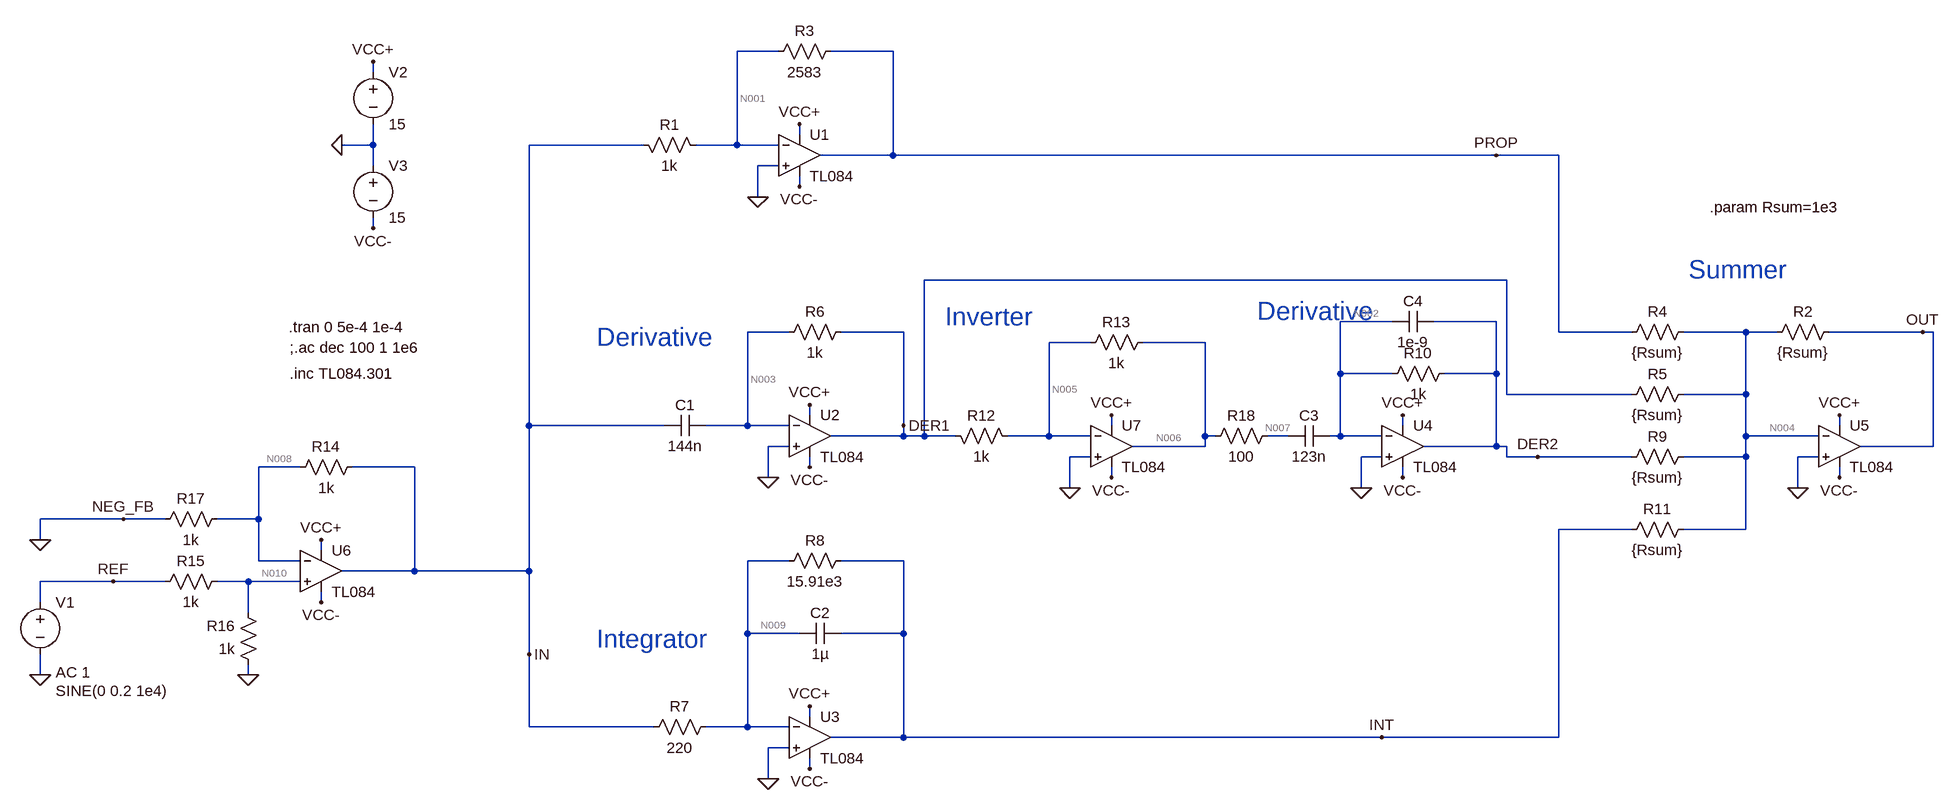
[diagram p0: schematic circuit.asc]
circuit.asc, the LTspice schematic file:
Version 4
SHEET 1 1592 1364
WIRE -208 -64 -272 -64
WIRE -32 -64 -128 -64
WIRE -832 -32 -832 -48
WIRE -176 64 -176 48
WIRE -832 80 -832 48
WIRE -832 80 -880 80
WIRE -416 80 -592 80
WIRE -272 80 -272 -64
WIRE -272 80 -336 80
WIRE -208 80 -272 80
WIRE -32 96 -32 -64
WIRE -32 96 -144 96
WIRE 896 96 -32 96
WIRE 992 96 896 96
WIRE -832 112 -832 80
WIRE -208 112 -240 112
WIRE -176 144 -176 128
WIRE -240 160 -240 112
WIRE -832 208 -832 192
WIRE 912 288 16 288
WIRE 736 352 656 352
WIRE 896 352 800 352
WIRE -192 368 -256 368
WIRE -16 368 -112 368
WIRE 992 368 992 96
WIRE 1104 368 992 368
WIRE 1280 368 1184 368
WIRE 1328 368 1280 368
WIRE 1552 368 1408 368
WIRE 1568 368 1552 368
WIRE 272 384 208 384
WIRE 448 384 352 384
WIRE 656 432 656 352
WIRE 736 432 656 432
WIRE 896 432 896 352
WIRE 896 432 816 432
WIRE 912 464 912 288
WIRE 1104 464 912 464
WIRE 1280 464 1280 368
WIRE 1280 464 1184 464
WIRE -160 496 -160 480
WIRE -592 512 -592 80
WIRE -384 512 -592 512
WIRE -256 512 -256 368
WIRE -256 512 -320 512
WIRE -192 512 -256 512
WIRE -16 512 -16 368
WIRE 304 512 304 496
WIRE 752 512 752 496
WIRE 1424 512 1424 496
WIRE -16 528 -16 512
WIRE -16 528 -128 528
WIRE 16 528 16 288
WIRE 16 528 -16 528
WIRE 64 528 16 528
WIRE 208 528 208 384
WIRE 208 528 144 528
WIRE 272 528 208 528
WIRE 448 528 448 384
WIRE 464 528 448 528
WIRE 576 528 544 528
WIRE 656 528 656 432
WIRE 656 528 640 528
WIRE 720 528 656 528
WIRE 1280 528 1280 464
WIRE 1392 528 1280 528
WIRE -192 544 -224 544
WIRE 448 544 448 528
WIRE 448 544 336 544
WIRE 896 544 896 432
WIRE 896 544 784 544
WIRE 912 544 896 544
WIRE 1568 544 1568 368
WIRE 1568 544 1456 544
WIRE 272 560 240 560
WIRE 720 560 688 560
WIRE 912 560 912 544
WIRE 960 560 912 560
WIRE 1104 560 960 560
WIRE 1280 560 1280 528
WIRE 1280 560 1184 560
WIRE 1392 560 1360 560
WIRE -944 576 -1008 576
WIRE -768 576 -864 576
WIRE -160 576 -160 560
WIRE -224 592 -224 544
WIRE 304 592 304 576
WIRE 752 592 752 576
WIRE 1424 592 1424 576
WIRE 240 608 240 560
WIRE 688 608 688 560
WIRE 1360 608 1360 560
WIRE -1216 656 -1344 656
WIRE -1152 656 -1216 656
WIRE -1008 656 -1008 576
WIRE -1008 656 -1072 656
WIRE 1104 672 992 672
WIRE 1280 672 1280 560
WIRE 1280 672 1184 672
WIRE -1344 688 -1344 656
WIRE -912 704 -912 688
WIRE -1008 720 -1008 656
WIRE -944 720 -1008 720
WIRE -192 720 -256 720
WIRE -16 720 -112 720
WIRE -768 736 -768 576
WIRE -768 736 -880 736
WIRE -592 736 -592 512
WIRE -592 736 -768 736
WIRE -1232 752 -1344 752
WIRE -1152 752 -1232 752
WIRE -1024 752 -1072 752
WIRE -944 752 -1024 752
WIRE -1344 784 -1344 752
WIRE -912 784 -912 768
WIRE -1024 800 -1024 752
WIRE -256 832 -256 720
WIRE -176 832 -256 832
WIRE -16 832 -16 720
WIRE -16 832 -112 832
WIRE -592 864 -592 736
WIRE -1344 896 -1344 864
WIRE -1024 896 -1024 880
WIRE -160 960 -160 944
WIRE -592 976 -592 864
WIRE -400 976 -592 976
WIRE -256 976 -256 832
WIRE -256 976 -320 976
WIRE -192 976 -256 976
WIRE -16 992 -16 832
WIRE -16 992 -128 992
WIRE 720 992 -16 992
WIRE 992 992 992 672
WIRE 992 992 720 992
WIRE -192 1008 -224 1008
WIRE -160 1040 -160 1024
WIRE -224 1056 -224 1008
FLAG -240 160 0
FLAG -880 80 0
FLAG -832 208 VCC-
FLAG -832 -48 VCC+
FLAG -176 48 VCC+
FLAG -176 144 VCC-
FLAG -1344 896 0
FLAG -224 592 0
FLAG -160 480 VCC+
FLAG -160 576 VCC-
FLAG -224 1056 0
FLAG -160 944 VCC+
FLAG -160 1040 VCC-
FLAG 688 608 0
FLAG 752 496 VCC+
FLAG 752 592 VCC-
FLAG 1360 608 0
FLAG 1424 496 VCC+
FLAG 1424 592 VCC-
FLAG 896 96 PROP
FLAG 1552 368 OUT
FLAG -16 512 DER1
FLAG 960 560 DER2
FLAG 720 992 INT
FLAG -592 864 IN
FLAG 240 608 0
FLAG 304 496 VCC+
FLAG 304 592 VCC-
FLAG -912 688 VCC+
FLAG -912 784 VCC-
FLAG -1024 896 0
FLAG -1232 752 REF
FLAG -1216 656 NEG_FB
FLAG -1344 688 0
SYMBOL Opamps\\opamp2 -176 32 R0
SYMATTR InstName U1
SYMATTR Value TL084
SYMBOL res -432 64 M90
WINDOW 0 0 56 VBottom 2
WINDOW 3 32 56 VTop 2
SYMATTR InstName R1
SYMATTR Value 1k
SYMBOL voltage -1344 768 R0
WINDOW 3 24 152 Left 2
WINDOW 123 24 124 Left 2
WINDOW 39 0 0 Left 0
SYMATTR Value SINE(0 0.2 1e4)
SYMATTR Value2 AC 1
SYMATTR InstName V1
SYMBOL voltage -832 -48 R0
WINDOW 123 0 0 Left 0
WINDOW 39 0 0 Left 0
SYMATTR InstName V2
SYMATTR Value 15
SYMBOL voltage -832 96 R0
WINDOW 123 0 0 Left 0
WINDOW 39 0 0 Left 0
SYMATTR InstName V3
SYMATTR Value 15
SYMBOL res -112 -80 R90
WINDOW 0 0 56 VBottom 2
WINDOW 3 32 56 VTop 2
SYMATTR InstName R3
SYMATTR Value 2583
SYMBOL Opamps\\opamp2 -160 464 R0
SYMATTR InstName U2
SYMATTR Value TL084
SYMBOL res -96 352 R90
WINDOW 0 0 56 VBottom 2
WINDOW 3 32 56 VTop 2
SYMATTR InstName R6
SYMATTR Value 1k
SYMBOL cap -320 496 R90
WINDOW 0 0 32 VBottom 2
WINDOW 3 32 32 VTop 2
SYMATTR InstName C1
SYMATTR Value 144n
SYMBOL Opamps\\opamp2 -160 928 R0
SYMATTR InstName U3
SYMATTR Value TL084
SYMBOL res -304 960 R90
WINDOW 0 0 56 VBottom 2
WINDOW 3 32 56 VTop 2
SYMATTR InstName R7
SYMATTR Value 220
SYMBOL cap -112 816 R90
WINDOW 0 0 32 VBottom 2
WINDOW 3 32 32 VTop 2
SYMATTR InstName C2
SYMATTR Value 1µ
SYMBOL res -96 704 R90
WINDOW 0 0 56 VBottom 2
WINDOW 3 32 56 VTop 2
SYMATTR InstName R8
SYMATTR Value 15.91e3
SYMBOL Opamps\\opamp2 752 480 R0
SYMATTR InstName U4
SYMATTR Value TL084
SYMBOL res 832 416 R90
WINDOW 0 0 56 VBottom 2
WINDOW 3 32 56 VTop 2
SYMATTR InstName R10
SYMATTR Value 1k
SYMBOL cap 640 512 R90
WINDOW 0 0 32 VBottom 2
WINDOW 3 32 32 VTop 2
SYMATTR InstName C3
SYMATTR Value 123n
SYMBOL Opamps\\opamp2 1424 480 R0
SYMATTR InstName U5
SYMATTR Value TL084
SYMBOL res 1424 352 R90
WINDOW 0 0 56 VBottom 2
WINDOW 3 32 56 VTop 2
SYMATTR InstName R2
SYMATTR Value {Rsum}
SYMBOL res 1200 352 R90
WINDOW 0 0 56 VBottom 2
WINDOW 3 32 56 VTop 2
SYMATTR InstName R4
SYMATTR Value {Rsum}
SYMBOL res 1200 448 R90
WINDOW 0 0 56 VBottom 2
WINDOW 3 32 56 VTop 2
SYMATTR InstName R5
SYMATTR Value {Rsum}
SYMBOL res 1200 544 R90
WINDOW 0 0 56 VBottom 2
WINDOW 3 32 56 VTop 2
SYMATTR InstName R9
SYMATTR Value {Rsum}
SYMBOL res 1200 656 R90
WINDOW 0 0 56 VBottom 2
WINDOW 3 32 56 VTop 2
SYMATTR InstName R11
SYMATTR Value {Rsum}
SYMBOL Opamps\\opamp2 304 480 R0
SYMATTR InstName U7
SYMATTR Value TL084
SYMBOL res 48 512 M90
WINDOW 0 0 56 VBottom 2
WINDOW 3 32 56 VTop 2
SYMATTR InstName R12
SYMATTR Value 1k
SYMBOL res 368 368 R90
WINDOW 0 0 56 VBottom 2
WINDOW 3 32 56 VTop 2
SYMATTR InstName R13
SYMATTR Value 1k
SYMBOL Opamps\\opamp2 -912 672 R0
SYMATTR InstName U6
SYMATTR Value TL084
SYMBOL res -848 560 R90
WINDOW 0 0 56 VBottom 2
WINDOW 3 32 56 VTop 2
SYMATTR InstName R14
SYMATTR Value 1k
SYMBOL res -1056 736 R90
WINDOW 0 0 56 VBottom 2
WINDOW 3 32 56 VTop 2
SYMATTR InstName R15
SYMATTR Value 1k
SYMBOL res -1008 896 R180
WINDOW 0 36 76 Left 2
WINDOW 3 36 40 Left 2
SYMATTR InstName R16
SYMATTR Value 1k
SYMBOL res -1056 640 R90
WINDOW 0 0 56 VBottom 2
WINDOW 3 32 56 VTop 2
SYMATTR InstName R17
SYMATTR Value 1k
SYMBOL res 560 512 R90
WINDOW 0 0 56 VBottom 2
WINDOW 3 32 56 VTop 2
SYMATTR InstName R18
SYMATTR Value 100
SYMBOL cap 800 336 R90
WINDOW 0 0 32 VBottom 2
WINDOW 3 32 32 VTop 2
SYMATTR InstName C4
SYMATTR Value 1e-9
TEXT -960 392 Left 2 !;.ac dec 100 1 1e6
TEXT -960 432 Left 2 !.inc TL084.301
TEXT 48 344 Left 4 ;Inverter
TEXT -488 376 Left 4 ;Derivative
TEXT -488 840 Left 4 ;Integrator
TEXT 528 336 Left 4 ;Derivative
TEXT 1224 176 Left 2 !.param Rsum=1e3
TEXT 1192 272 Left 4 ;Summer
TEXT -962 360 Left 2 !.tran 0 5e-4 1e-4

The netlist it stands for:
* circuit.asc
XU1 0 N001 VCC+ VCC- PROP TL084  ; pins In+ In- V+ V- OUT
R1 IN N001 1k
V1 REF 0 SINE(0 0.2 1e4) AC 1
V2 VCC+ 0 15
V3 0 VCC- 15
R3 PROP N001 2583
XU2 0 N003 VCC+ VCC- DER1 TL084  ; pins In+ In- V+ V- OUT
R6 DER1 N003 1k
C1 N003 IN 144n
XU3 0 N009 VCC+ VCC- INT TL084  ; pins In+ In- V+ V- OUT
R7 N009 IN 220
C2 INT N009 1µ
R8 INT N009 15.91e3
XU4 0 N002 VCC+ VCC- DER2 TL084  ; pins In+ In- V+ V- OUT
R10 DER2 N002 1k
C3 N002 N007 123n
XU5 0 N004 VCC+ VCC- OUT TL084  ; pins In+ In- V+ V- OUT
R2 OUT N004 {Rsum}
R4 N004 PROP {Rsum}
R5 N004 DER1 {Rsum}
R9 N004 DER2 {Rsum}
R11 N004 INT {Rsum}
XU7 0 N005 VCC+ VCC- N006 TL084  ; pins In+ In- V+ V- OUT
R12 DER1 N005 1k
R13 N006 N005 1k
XU6 N010 N008 VCC+ VCC- IN TL084  ; pins In+ In- V+ V- OUT
R14 IN N008 1k
R15 N010 REF 1k
R16 0 N010 1k
R17 N008 0 1k
R18 N007 N006 100
C4 DER2 N002 1e-9
;.ac dec 100 1 1e6
.inc TL084.301
* Inverter
* Derivative
* Integrator
* Derivative
.param Rsum=1e3
* Summer
.tran 0 5e-4 1e-4
.backanno
.end

* Results of the author's LTspice run, read from the files saved beside the schematic
* Operating Point, zero values left out:
*   V(prop) = -17.25 µV
*   V(vcc-) = -15 V
*   V(vcc+) = 15 V
*   V(n001) = 10.97 µV
*   V(in) = 21.94 µV
*   V(der1) = 11.02 µV
*   V(n003) = 10.97 µV
*   V(int) = -781.3 µV
*   V(n009) = 10.98 µV
*   V(der2) = 11.02 µV
*   V(n002) = 10.97 µV
*   V(n007) = 10.97 µV
*   V(out) = 831.4 µV
*   V(n004) = 10.97 µV
*   V(n006) = 10.97 µV
*   V(n005) = 10.97 µV
*   V(n008) = 10.95 µV
*   V(n010) = -22.53 nV
*   I(R17) = 10.95 nA
*   I(R16) = 22.53 pA
*   I(R15) = -22.53 pA
*   I(R14) = 10.99 nA
*   I(R12) = 45.05 pA
*   I(R11) = 792.3 nA
*   I(R9) = -49.71 pA
*   I(R5) = -49.71 pA
*   I(R4) = 28.21 nA
*   I(R2) = 820.5 nA
*   I(R10) = 45.05 pA
*   I(R8) = -49.8 nA
*   I(R7) = -49.84 nA
*   I(R6) = 45.05 pA
*   I(R3) = -10.93 nA
*   I(R1) = 10.97 nA
*   I(V3) = -99.36 mA
*   I(V2) = -99.36 mA
*   I(V1) = -22.53 pA
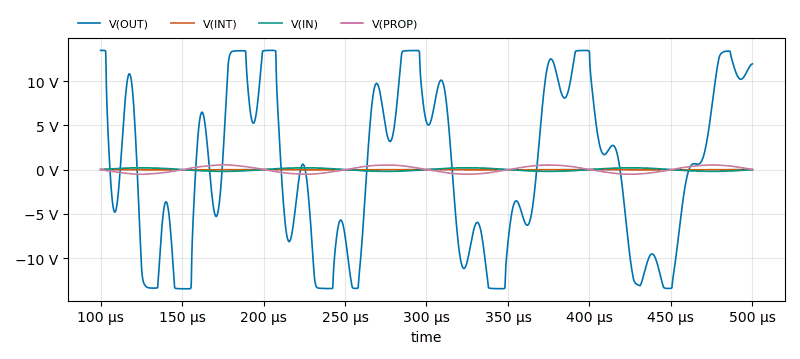
[diagram p1: Transient Analysis of circuit.asc, plotted from the saved traces]
* Transient Analysis, 1 run:
*   V(OUT): min -13.47 V, max 13.47 V, average 74.75 mV, rms 9.422 V, last 11.94 V
*   V(INT): min -35.03 mV, max 5.971 mV, average -14.97 mV, rms 18.37 mV, last 270.2 µV
*   V(IN): min -205.3 mV, max 205.6 mV, average 36.34 µV, rms 142.5 mV, last -2.725 mV
*   V(PROP): min -534.2 mV, max 529.8 mV, average -41.42 µV, rms 368.1 mV, last 13.98 mV